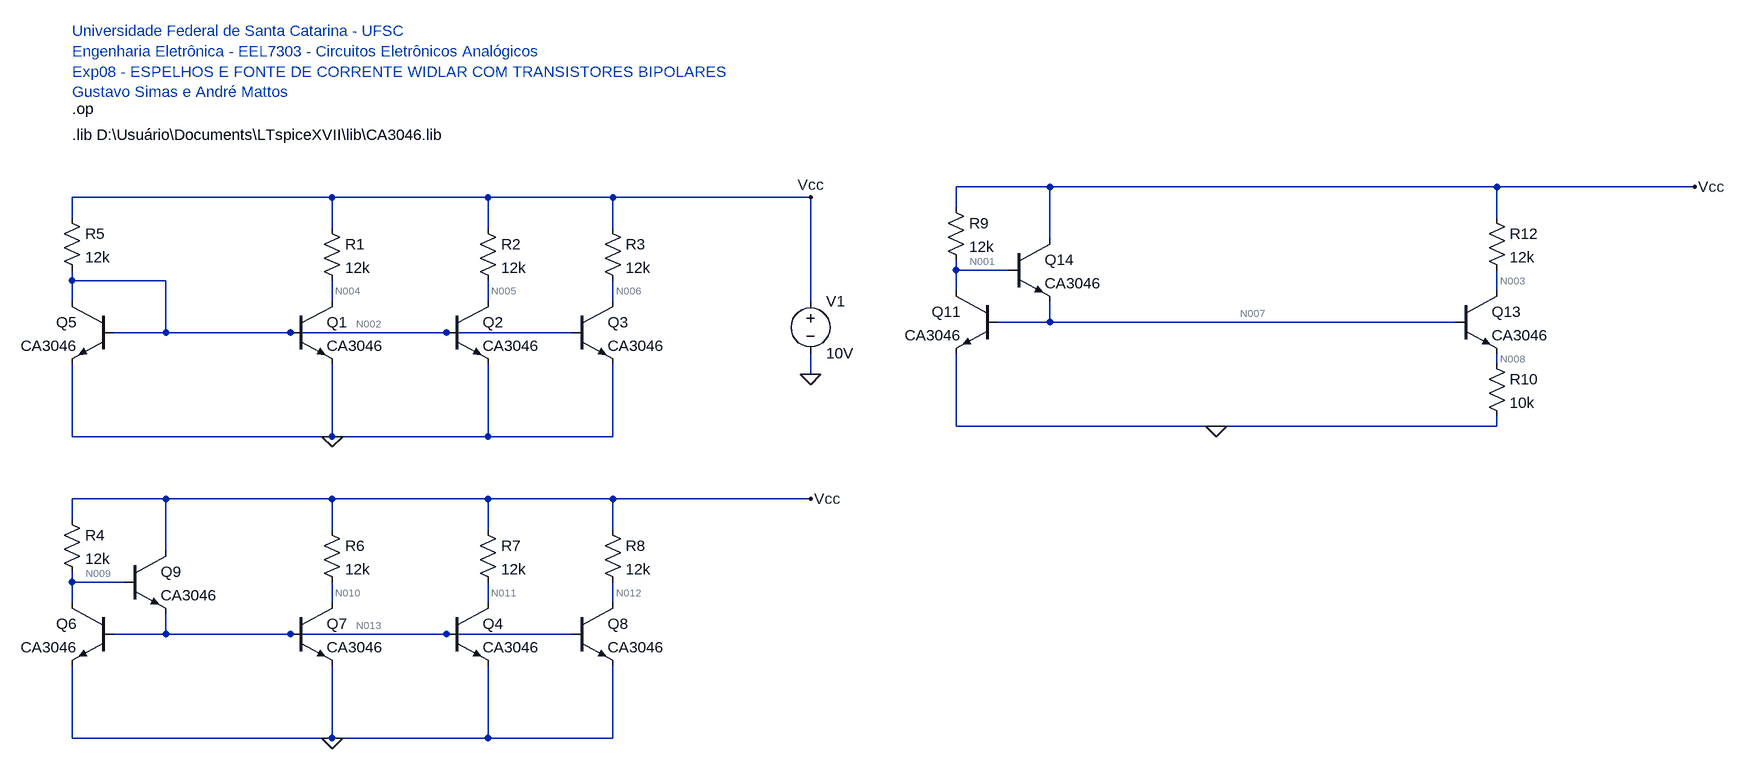
[diagram p0: schematic Lab08.asc]
Lab08.asc, the LTspice schematic file:
Version 4
SHEET 1 2456 932
WIRE 1408 64 1264 64
WIRE 2096 64 1408 64
WIRE 2400 64 2096 64
WIRE 304 80 -96 80
WIRE 544 80 304 80
WIRE 736 80 544 80
WIRE 1040 80 736 80
WIRE 1264 96 1264 64
WIRE -96 112 -96 80
WIRE 2096 112 2096 64
WIRE 304 128 304 80
WIRE 544 128 544 80
WIRE 736 128 736 80
WIRE 1408 144 1408 64
WIRE 1264 192 1264 176
WIRE 1344 192 1264 192
WIRE -96 208 -96 192
WIRE 48 208 -96 208
WIRE 1264 224 1264 192
WIRE 2096 224 2096 192
WIRE -96 240 -96 208
WIRE 304 240 304 208
WIRE 544 240 544 208
WIRE 736 240 736 208
WIRE 1040 240 1040 80
WIRE 1408 272 1408 240
WIRE 1408 272 1328 272
WIRE 2032 272 1408 272
WIRE 48 288 48 208
WIRE 48 288 -32 288
WIRE 240 288 48 288
WIRE 480 288 240 288
WIRE 672 288 480 288
WIRE 2096 336 2096 320
WIRE 1040 352 1040 320
WIRE 1264 432 1264 320
WIRE 1664 432 1264 432
WIRE 2096 432 2096 416
WIRE 2096 432 1664 432
WIRE -96 448 -96 336
WIRE 304 448 304 336
WIRE 304 448 -96 448
WIRE 544 448 544 336
WIRE 544 448 304 448
WIRE 736 448 736 336
WIRE 736 448 544 448
WIRE 48 544 -96 544
WIRE 304 544 48 544
WIRE 544 544 304 544
WIRE 736 544 544 544
WIRE 1040 544 736 544
WIRE -96 576 -96 544
WIRE 304 592 304 544
WIRE 544 592 544 544
WIRE 736 592 736 544
WIRE 48 624 48 544
WIRE -96 672 -96 656
WIRE -16 672 -96 672
WIRE -96 704 -96 672
WIRE 304 704 304 672
WIRE 544 704 544 672
WIRE 736 704 736 672
WIRE 48 752 48 720
WIRE 48 752 -32 752
WIRE 240 752 48 752
WIRE 480 752 240 752
WIRE 672 752 480 752
WIRE -96 912 -96 800
WIRE 304 912 304 800
WIRE 304 912 -96 912
WIRE 544 912 544 800
WIRE 544 912 304 912
WIRE 736 912 736 800
WIRE 736 912 544 912
FLAG 1040 352 0
FLAG 304 448 0
FLAG 1040 80 Vcc
FLAG 304 912 0
FLAG 1040 544 Vcc
FLAG 1664 432 0
FLAG 2400 64 Vcc
SYMBOL npn 480 240 R0
SYMATTR InstName Q2
SYMATTR Value CA3046
SYMBOL voltage 1040 224 R0
WINDOW 123 0 0 Left 0
WINDOW 39 0 0 Left 0
SYMATTR InstName V1
SYMATTR Value 10V
SYMBOL npn -32 240 M0
SYMATTR InstName Q5
SYMATTR Value CA3046
SYMBOL npn 240 240 R0
SYMATTR InstName Q1
SYMATTR Value CA3046
SYMBOL npn 672 240 R0
SYMATTR InstName Q3
SYMATTR Value CA3046
SYMBOL res -112 96 R0
SYMATTR InstName R5
SYMATTR Value 12k
SYMBOL res 288 112 R0
SYMATTR InstName R1
SYMATTR Value 12k
SYMBOL res 528 112 R0
SYMATTR InstName R2
SYMATTR Value 12k
SYMBOL res 720 112 R0
SYMATTR InstName R3
SYMATTR Value 12k
SYMBOL npn 480 704 R0
SYMATTR InstName Q4
SYMATTR Value CA3046
SYMBOL npn -32 704 M0
SYMATTR InstName Q6
SYMATTR Value CA3046
SYMBOL npn 240 704 R0
SYMATTR InstName Q7
SYMATTR Value CA3046
SYMBOL npn 672 704 R0
SYMATTR InstName Q8
SYMATTR Value CA3046
SYMBOL res -112 560 R0
SYMATTR InstName R4
SYMATTR Value 12k
SYMBOL res 288 576 R0
SYMATTR InstName R6
SYMATTR Value 12k
SYMBOL res 528 576 R0
SYMATTR InstName R7
SYMATTR Value 12k
SYMBOL res 720 576 R0
SYMATTR InstName R8
SYMATTR Value 12k
SYMBOL npn -16 624 R0
SYMATTR InstName Q9
SYMATTR Value CA3046
SYMBOL npn 1328 224 M0
SYMATTR InstName Q11
SYMATTR Value CA3046
SYMBOL npn 2032 224 R0
SYMATTR InstName Q13
SYMATTR Value CA3046
SYMBOL res 1248 80 R0
SYMATTR InstName R9
SYMATTR Value 12k
SYMBOL res 2080 96 R0
SYMATTR InstName R12
SYMATTR Value 12k
SYMBOL npn 1344 144 R0
SYMATTR InstName Q14
SYMATTR Value CA3046
SYMBOL res 2080 320 R0
SYMATTR InstName R10
SYMATTR Value 10k
TEXT -96 -56 Left 2 !.op
TEXT -96 -176 Left 2 ;Universidade Federal de Santa Catarina - UFSC\nEngenharia Eletrônica - EEL7303 - Circuitos Eletrônicos Analógicos\nExp08 - ESPELHOS E FONTE DE CORRENTE WIDLAR COM TRANSISTORES BIPOLARES\nGustavo Simas e André Mattos
TEXT -96 -16 Left 2 !.lib D:\\Usuário\\Documents\\LTspiceXVII\\lib\\CA3046.lib

The netlist it stands for:
* Lab08.asc
Q2 N005 N002 0 0 CA3046
V1 Vcc 0 10V
Q5 N002 N002 0 0 CA3046
Q1 N004 N002 0 0 CA3046
Q3 N006 N002 0 0 CA3046
R5 Vcc N002 12k
R1 Vcc N004 12k
R2 Vcc N005 12k
R3 Vcc N006 12k
Q4 N011 N013 0 0 CA3046
Q6 N009 N013 0 0 CA3046
Q7 N010 N013 0 0 CA3046
Q8 N012 N013 0 0 CA3046
R4 Vcc N009 12k
R6 Vcc N010 12k
R7 Vcc N011 12k
R8 Vcc N012 12k
Q9 Vcc N009 N013 0 CA3046
Q11 N001 N007 0 0 CA3046
Q13 N003 N007 N008 0 CA3046
R9 Vcc N001 12k
R12 Vcc N003 12k
Q14 Vcc N001 N007 0 CA3046
R10 N008 0 10k
.model NPN NPN
.model PNP PNP
.lib standard.bjt
.op
* Universidade Federal de Santa Catarina - UFSC
* Engenharia Eletrônica - EEL7303 - Circuitos Eletrônicos Analógicos
* Exp08 - ESPELHOS E FONTE DE CORRENTE WIDLAR COM TRANSISTORES BIPOLARES
* Gustavo Simas e André Mattos
.lib D:\Usuário\Documents\LTspiceXVII\lib\CA3046.lib
.backanno
.end

* Results of the author's LTspice run, read from the files saved beside the schematic
* Operating Point:
*   V(n005) = 989.2 mV
*   V(n002) = 648.2 mV
*   V(vcc) = 10 V
*   V(n004) = 989.2 mV
*   V(n006) = 989.2 mV
*   V(n011) = 1.215 V
*   V(n013) = 647.5 mV
*   V(n009) = 1.21 V
*   V(n010) = 1.215 V
*   V(n012) = 1.215 V
*   V(n001) = 1.175 V
*   V(n007) = 647.6 mV
*   V(n003) = 9.869 V
*   V(n008) = 111.4 mV
*   Ic(Q14) = 7.635 µA
*   Ib(Q14) = 154.1 nA
*   Ie(Q14) = -7.789 µA
*   Ic(Q13) = 10.94 µA
*   Ib(Q13) = 203.5 nA
*   Ie(Q13) = -11.14 µA
*   Ic(Q11) = 735.3 µA
*   Ib(Q11) = 7.586 µA
*   Ie(Q11) = -742.9 µA
*   Ic(Q9) = 29.76 µA
*   Ib(Q9) = 453.6 nA
*   Ie(Q9) = -30.21 µA
*   Ic(Q8) = 732.1 µA
*   Ib(Q8) = 7.553 µA
*   Ie(Q8) = -739.7 µA
*   Ic(Q7) = 732.1 µA
*   Ib(Q7) = 7.553 µA
*   Ie(Q7) = -739.7 µA
*   Ic(Q6) = 732.1 µA
*   Ib(Q6) = 7.553 µA
*   Ie(Q6) = -739.6 µA
*   Ic(Q4) = 732.1 µA
*   Ib(Q4) = 7.553 µA
*   Ie(Q4) = -739.7 µA
*   Ic(Q3) = 750.9 µA
*   Ib(Q3) = 7.745 µA
*   Ie(Q3) = -758.6 µA
*   Ic(Q1) = 750.9 µA
*   Ib(Q1) = 7.745 µA
*   Ie(Q1) = -758.6 µA
*   Ic(Q5) = 748.3 µA
*   Ib(Q5) = 7.745 µA
*   Ie(Q5) = -756.1 µA
*   Ic(Q2) = 750.9 µA
*   Ib(Q2) = 7.745 µA
*   Ie(Q2) = -758.6 µA
*   I(R10) = 11.14 µA
*   I(R12) = 10.94 µA
*   I(R9) = 735.5 µA
*   I(R8) = 732.1 µA
*   I(R7) = 732.1 µA
*   I(R6) = 732.1 µA
*   I(R4) = 732.5 µA
*   I(R3) = 750.9 µA
*   I(R2) = 750.9 µA
*   I(R1) = 750.9 µA
*   I(R5) = 779.3 µA
*   I(V1) = -6.745 mA
* From the log:
*   Semiconductor Device Operating Points:
*                           --- Bipolar Transistors ---
*   Name:       q14         q13         q11         q9          q8
*   Model:    ca3046      ca3046      ca3046      ca3046      ca3046
*   Ib:       1.54e-07    2.03e-07    7.59e-06    4.54e-07    7.55e-06
*   Ic:       7.64e-06    1.09e-05    7.35e-04    2.98e-05    7.32e-04
*   Vbe:      5.27e-01    5.36e-01    6.48e-01    5.62e-01    6.47e-01
*   Vbc:     -8.83e+00   -9.22e+00   -5.27e-01   -8.79e+00   -5.67e-01
*   Vce:      9.35e+00    9.76e+00    1.17e+00    9.35e+00    1.21e+00
*   BetaDC:   4.95e+01    5.38e+01    9.69e+01    6.56e+01    9.69e+01
*   Gm:       2.95e-04    4.23e-04    2.80e-02    1.15e-03    2.79e-02
*   Rpi:      2.16e+05    1.62e+05    3.81e+03    7.04e+04    3.83e+03
*   Rx:       0.00e+00    0.00e+00    0.00e+00    0.00e+00    0.00e+00
*   Ro:       1.42e+07    9.94e+06    1.36e+05    3.64e+06    1.36e+05
*   Cbe:      1.55e-12    1.60e-12    9.36e-12    1.83e-12    9.33e-12
*   Cbc:      4.24e-13    4.19e-13    8.32e-13    4.25e-13    8.24e-13
*   Cjs:      0.00e+00    0.00e+00    0.00e+00    0.00e+00    0.00e+00
*   BetaAC:   6.38e+01    6.84e+01    1.07e+02    8.09e+01    1.07e+02
*   Cbx:      0.00e+00    0.00e+00    0.00e+00    0.00e+00    0.00e+00
*   Ft:       2.38e+07    3.34e+07    4.37e+08    8.12e+07    4.37e+08
*   Name:       q7          q6          q4          q3          q1
*   Model:    ca3046      ca3046      ca3046      ca3046      ca3046
*   Ib:       7.55e-06    7.55e-06    7.55e-06    7.75e-06    7.75e-06
*   Ic:       7.32e-04    7.32e-04    7.32e-04    7.51e-04    7.51e-04
*   Vbe:      6.47e-01    6.47e-01    6.47e-01    6.48e-01    6.48e-01
*   Vbc:     -5.67e-01   -5.62e-01   -5.67e-01   -3.41e-01   -3.41e-01
*   Vce:      1.21e+00    1.21e+00    1.21e+00    9.89e-01    9.89e-01
*   BetaDC:   9.69e+01    9.69e+01    9.69e+01    9.70e+01    9.70e+01
*   Gm:       2.79e-02    2.79e-02    2.79e-02    2.86e-02    2.86e-02
*   Rpi:      3.83e+03    3.83e+03    3.83e+03    3.73e+03    3.73e+03
*   Rx:       0.00e+00    0.00e+00    0.00e+00    0.00e+00    0.00e+00
*   Ro:       1.36e+05    1.36e+05    1.36e+05    1.33e+05    1.33e+05
*   Cbe:      9.33e-12    9.33e-12    9.33e-12    9.52e-12    9.52e-12
*   Cbc:      8.24e-13    8.25e-13    8.24e-13    8.77e-13    8.77e-13
*   Cjs:      0.00e+00    0.00e+00    0.00e+00    0.00e+00    0.00e+00
*   BetaAC:   1.07e+02    1.07e+02    1.07e+02    1.07e+02    1.07e+02
*   Cbx:      0.00e+00    0.00e+00    0.00e+00    0.00e+00    0.00e+00
*   Ft:       4.37e+08    4.37e+08    4.37e+08    4.37e+08    4.37e+08
*   Name:       q5          q2
*   Model:    ca3046      ca3046
*   Ib:       7.75e-06    7.75e-06
*   Ic:       7.48e-04    7.51e-04
*   Vbe:      6.48e-01    6.48e-01
*   Vbc:      0.00e+00   -3.41e-01
*   Vce:      6.48e-01    9.89e-01
*   BetaDC:   9.66e+01    9.70e+01
*   Gm:       2.85e-02    2.86e-02
*   Rpi:      3.73e+03    3.73e+03
*   Rx:       0.00e+00    0.00e+00
*   Ro:       1.33e+05    1.33e+05
*   Cbe:      9.50e-12    9.52e-12
*   Cbc:      9.95e-13    8.77e-13
*   Cjs:      0.00e+00    0.00e+00
*   BetaAC:   1.06e+02    1.07e+02
*   Cbx:      0.00e+00    0.00e+00
*   Ft:       4.32e+08    4.37e+08